# Altium project Ax2WDRobot.PrjPcb
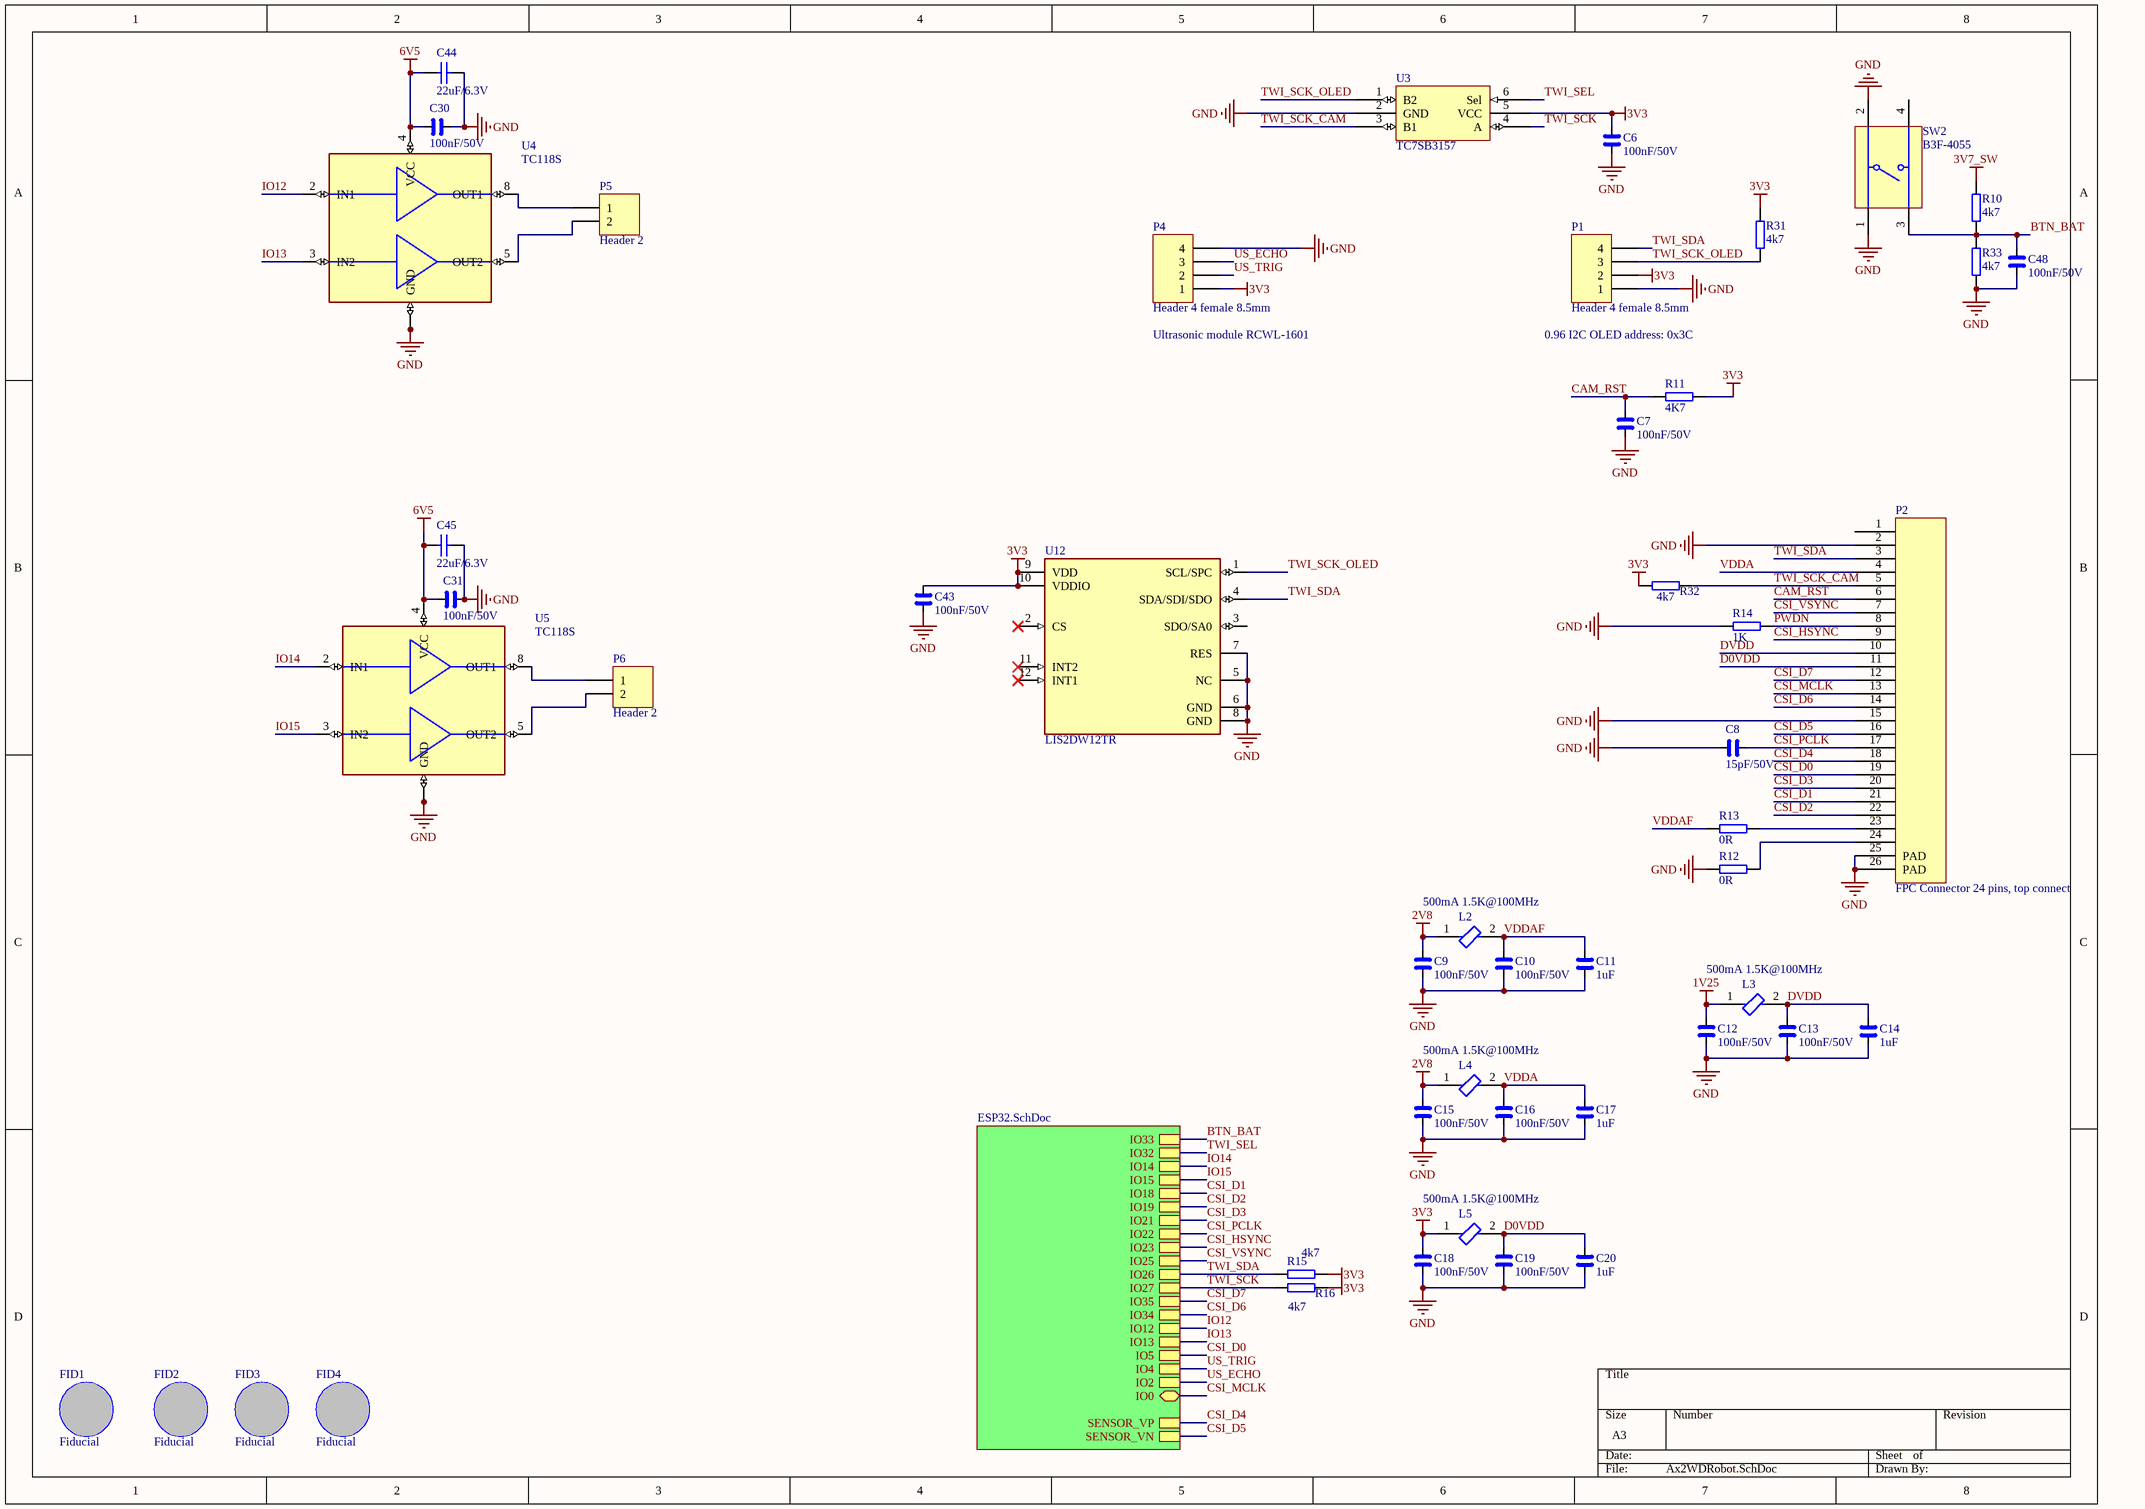
[diagram p0: Ax2WDRobot.SchDoc]
5 sheets, 123 parts. Net scope: hierarchical (ports join the sheet entries above them; power ports are global).
Board file: Ax2WDRobot.PcbDoc
Sheets:
  Ax2WDRobot.SchDoc
     = ESP32.SchDoc
       = CP2102.SchDoc
         = Power.SchDoc
          U_BatteryPower = BatteryPower.SchDoc

## Sheet Ax2WDRobot.SchDoc
size A3; SheetNumber: 1; SheetTotal: 5

### Parts
C6  100nF/50V  [1608[0603]]
C7  100nF/50V  [1608[0603]]
C8  15pF/50V  [1608[0603]]
C9  100nF/50V  [1608[0603]]
C10  100nF/50V  [1608[0603]]
C11  1uF  [1608[0603]]
C12  100nF/50V  [1608[0603]]
C13  100nF/50V  [1608[0603]]
C14  1uF  [1608[0603]]
C15  100nF/50V  [1608[0603]]
C16  100nF/50V  [1608[0603]]
C17  1uF  [1608[0603]]
C18  100nF/50V  [1608[0603]]
C19  100nF/50V  [1608[0603]]
C20  1uF  [1608[0603]]
C30  100nF/50V  [1608[0603]]
C31  100nF/50V  [1608[0603]]
C43  100nF/50V  [1608[0603]]
C44  22uF/6.3V  [1608[0603]]
C45  22uF/6.3V  [1608[0603]]
C48  100nF/50V  [1608[0603]]
FID1  Fiducial  [FIDUCIAL_POLY]  (no BOM)
FID2  Fiducial  [FIDUCIAL_POLY]  (no BOM)
FID3  Fiducial  [FIDUCIAL_POLY]  (no BOM)
FID4  Fiducial  [FIDUCIAL_POLY]  (no BOM)
L2  500mA 1.5K@100MHz  [1608[0603]]
L3  500mA 1.5K@100MHz  [1608[0603]]
L4  500mA 1.5K@100MHz  [1608[0603]]
L5  500mA 1.5K@100MHz  [1608[0603]]
P1  Header 4 female 8.5mm  [BCS-104-L-S-TE]
P2  FPC Connector 24 pins, top connect  [AFC07-S24ECA-00]
P4  Header 4 female 8.5mm  [BCS-104-L-S-TE]
P5  Header 2  [BCS-102-L-S-TE]
P6  Header 2  [BCS-102-L-S-TE]
R10  4k7  [1608[0603]]
R11  4K7  [1608[0603]]
R12  0R  [1608[0603]]  (no BOM)
R13  0R  [1608[0603]]  (no BOM)
R14  1K  [1608[0603]]
R15  4k7  [1608[0603]]
R16  4k7  [1608[0603]]
R31  4k7  [1608[0603]]
R32  4k7  [1608[0603]]
R33  4k7  [1608[0603]]
SW2  B3F-4055  [OMRON-B3F-4055_AX]
U3  TC7SB3157  [SOT-363_MP6D]
U4  TC118S  [SO08]
U5  TC118S  [SO08]
U12  LIS2DW12TR  [FP-LGA12-DM00170568-MFG]

### Sub-sheets
? = ESP32.SchDoc: IO2, IO5, IO34, IO35, IO27, IO26, IO25, IO23, IO22, IO21, IO19, IO18, IO15, SENSOR_VP, SENSOR_VN, IO0 (bidir), IO4, IO33, IO32, IO12, IO13, IO14

### Nets
1V25: C12.2 L3.1
2V8: C9.2 C15.2 L2.1 L4.1
3V3: C6.1 C18.2 C43.1 L5.1 P1.2 P4.1 R11.2 R15.1 R16.1 R31.2 R32.2 U3.5(VCC) U12.9(VDD) U12.10(VDDIO)
3V7_SW: R10.2
6V5: C30.2 C31.2 C44.2 C45.2 U4.4(VCC) U5.4(VCC)
GND: C6.2 C7.1 C8.1 C9.1 C10.1 C11.2 C12.1 C13.1 C14.2 C15.1 C16.1 C17.2 C18.1 C19.1 C20.2 C30.1 C31.1 C43.2 C44.1 C45.1 C48.1 P1.1 P2.2 P2.15 P2.25(PAD) P2.26(PAD) P4.4 R12.1 R14.1 R33.1 SW2.1 SW2.2 U3.2(GND) U4.6(GND) U4.7(GND) U5.6(GND) U5.7(GND) U12.5(NC) U12.6(GND) U12.7(RES) U12.8(GND)
BTN_BAT: C48.2 R10.1 R33.2 SW2.3 ; sheet /IO33
CAM_RST: C7.2 P2.6 R11.1
CSI_D0: P2.19 ; sheet /IO5
CSI_D1: P2.21 ; sheet /IO18
CSI_D2: P2.22 ; sheet /IO19
CSI_D3: P2.20 ; sheet /IO21
CSI_D4: P2.18 ; sheet /SENSOR_VP
CSI_D5: P2.16 ; sheet /SENSOR_VN
CSI_D6: P2.14 ; sheet /IO34
CSI_D7: P2.12 ; sheet /IO35
CSI_HSYNC: P2.9 ; sheet /IO23
CSI_MCLK: P2.13 ; sheet /IO0
CSI_PCLK: C8.2 P2.17 ; sheet /IO22
CSI_VSYNC: P2.7 ; sheet /IO25
D0VDD: C19.2 C20.1 L5.2 P2.11
DVDD: C13.2 C14.1 L3.2 P2.10
IO12: U4.2(IN1) ; sheet /IO12
IO13: U4.3(IN2) ; sheet /IO13
IO14: U5.2(IN1) ; sheet /IO14
IO15: U5.3(IN2) ; sheet /IO15
PWDN: P2.8 R14.2
TWI_SCK: R16.2 U3.4(A) ; sheet /IO27
TWI_SCK_CAM: P2.5 R32.1 U3.3(B1)
TWI_SCK_OLED: P1.3 R31.1 U3.1(B2) U12.1(SCL/SPC)
TWI_SDA: P1.4 P2.3 R15.2 U12.4(SDA/SDI/SDO) ; sheet /IO26
TWI_SEL: U3.6(Sel) ; sheet /IO32
US_ECHO: P4.3 ; sheet /IO2
US_TRIG: P4.2 ; sheet /IO4
VDDA: C16.2 C17.1 L4.2 P2.4
VDDAF: C10.2 C11.1 L2.2 R13.1
NetP2_23: P2.23 R13.2
NetP2_24: P2.24 R12.2
NetP5_1: P5.1 U4.8(OUT1)
NetP5_2: P5.2 U4.5(OUT2)
NetP6_1: P6.1 U5.8(OUT1)
NetP6_2: P6.2 U5.5(OUT2)

Not connected (* = marked no-connect by the designer): P2 1; SW2 4; U12 2(CS)* 3(SDO/SA0) 11(INT2)* 12(INT1)*

### Notes on the sheet
- (near P4) Ultrasonic module RCWL-1601
- 0.96 I2C OLED address: 0x3C

### Library data of the parts
C6 C7 C9 C10 C12 C13 C15 C16 C18 C19 C30 C31 C48 = C: Cap Ceramic 0.1uF 50V X7R 20% SMD 0603 125C Paper T/R; Supplier 1: Digi-Key; Supplier Part Number 1: 1276-1941-1-ND; Case/Package: 0603; LCSCPartNo: C14663
C8 = C: Cap Ceramic 0603; Supplier 1: Digi-Key; Case/Package: 0603; LCSCPartNo: C1644
C11 C14 C17 C20 = C: CAP CER 1UF 10V X5R 0603; Supplier 1: Digi-Key; Supplier Part Number 1: 1276-1866-1-ND; Case/Package: 0603; LCSCPartNo: C15849
C43 = C: Cap Ceramic 0.1uF 50V X7R 20% SMD 0603 125C Paper T/R; Manufacturer: Samsung; Manufacturer Part Number: CL10B104MB8NNNC; Supplier 1: Digi-Key; Supplier Part Number 1: 1276-1941-1-ND; Case/Package: 0603; LCSCPartNo: C14663
C44 C45 = Cap: Capacitor; LCSCPartNo: C59461; Case/Package: 0603
L2-L5 = CMP-0686-00368-3: Chip Ferrite Bead, 0603, 1500Ω @ 100MHz, 0.5Ω, 25%, 500mA; Case/Package: 0603; Supplier 1: Digi-Key; Supplier Part Number 1: 490-5216-1-ND; LCSCPartNo: C82155
P1 P4 = Header 4: Header, 4-Pin; Supplier 1: Digi-Key; LCSCPartNo: C124413
P2 = FPC-CONN-24: LCSCPartNo: C262643
P5 P6 = Header 2: Header, 2-Pin; LatestRevisionDate: 17-Jul-2002; LatestRevisionNote: Re-released for DXP Platform.; Publisher: Altium Limited; LCSCPartNo: C49661
R10 R15 R16 R31-R33 = R: RES SMD 4.7K OHM 1% 1/10W 0603; Supplier 1: Digi-Key; Supplier Part Number 1: 311-4.70KHRCT-ND; Case/Package: 0603; LCSCPartNo: C23162
R11-R14 = R: Res General Purpose Thick Film 0603 1% 1/10W ±100ppm/°C Molded SMD Paper T/R; Supplier 1: Digi-Key; Case/Package: 0603
  R11: LCSCPartNo: C23162
  R12 R13: LCSCPartNo: C21189
  R14: LCSCPartNo: C21190
SW2 = CMP-2000-05902-1: Tactile Switch, 1 to 50 mA, 100 mOhm Max, 5 to 24 VDC, -25 to 70 degC, 4-Pin THD, RoHS, Bulk; LCSCPartNo: C84931
U3 = TC7SB3157CFU: 1-of-2 multiplexer/demultiplexer; LCSCPartNo: C2674458; LCSCAltPartNo: C150170
U12 = CMP-12175-000006-1: ACCEL 2-16G I2C/SPI 12LGA; Manufacturer: STMicroelectronics; Min Supply Voltage: 1.62V; Operating Supply Current: 0.38-90uA; Sensor Output: I2C,SPI; Accel Resolution: 14bits; Max Supply Voltage: 3.6V; Accel Range: 2/4/8/16g; Height: 0.7mm; Device Class L1: Sensors; RoHS: TRUE; Temperature Range Low: -40°C; Category: IC; Mouser Description: Accelerometer Triple ±2g/±4g/±8g/±16g 1.62V to 3.6V 0.244mg/digit/0.488mg/digit/0.976mg/digit/1.952mg/digit 12-Pin LG...; Digikey Description: ACCEL 2-16G I2C/SPI 12LGA; ComponentLink2URL: https://www.st.com/resource/en/datasheet/lis2dw12.pdf; Automotive: No; Manufacturer Part Number: LIS2DW12TR; Lead Free: Yes; Footprint Url: https://www.st.com/content/ccc/resource/technical/document/technical_note/73/17/9c/16/dd/96/4a/01/CD00134799.pdf/files/CD00134799.pdf/jcr:content/translations/en.CD00134799.pdf; Temperature: -40°C to +85°C; Device Class L3: Accelerometers; Package: LGA12-DM00170568; Temperature Range High: +85°C; Device Class L2: Motion Sensors; Octopart: https://octopart.com/lis2dw12tr-stmicroelectronics-77080925; ComponentLink2Description: Datasheet; LCSCPartNo: C189624
U4 U5 = TC118S: LCSCPartNo: C88308

## Sheet ESP32.SchDoc
size A4; SheetNumber: 2; SheetTotal: 5
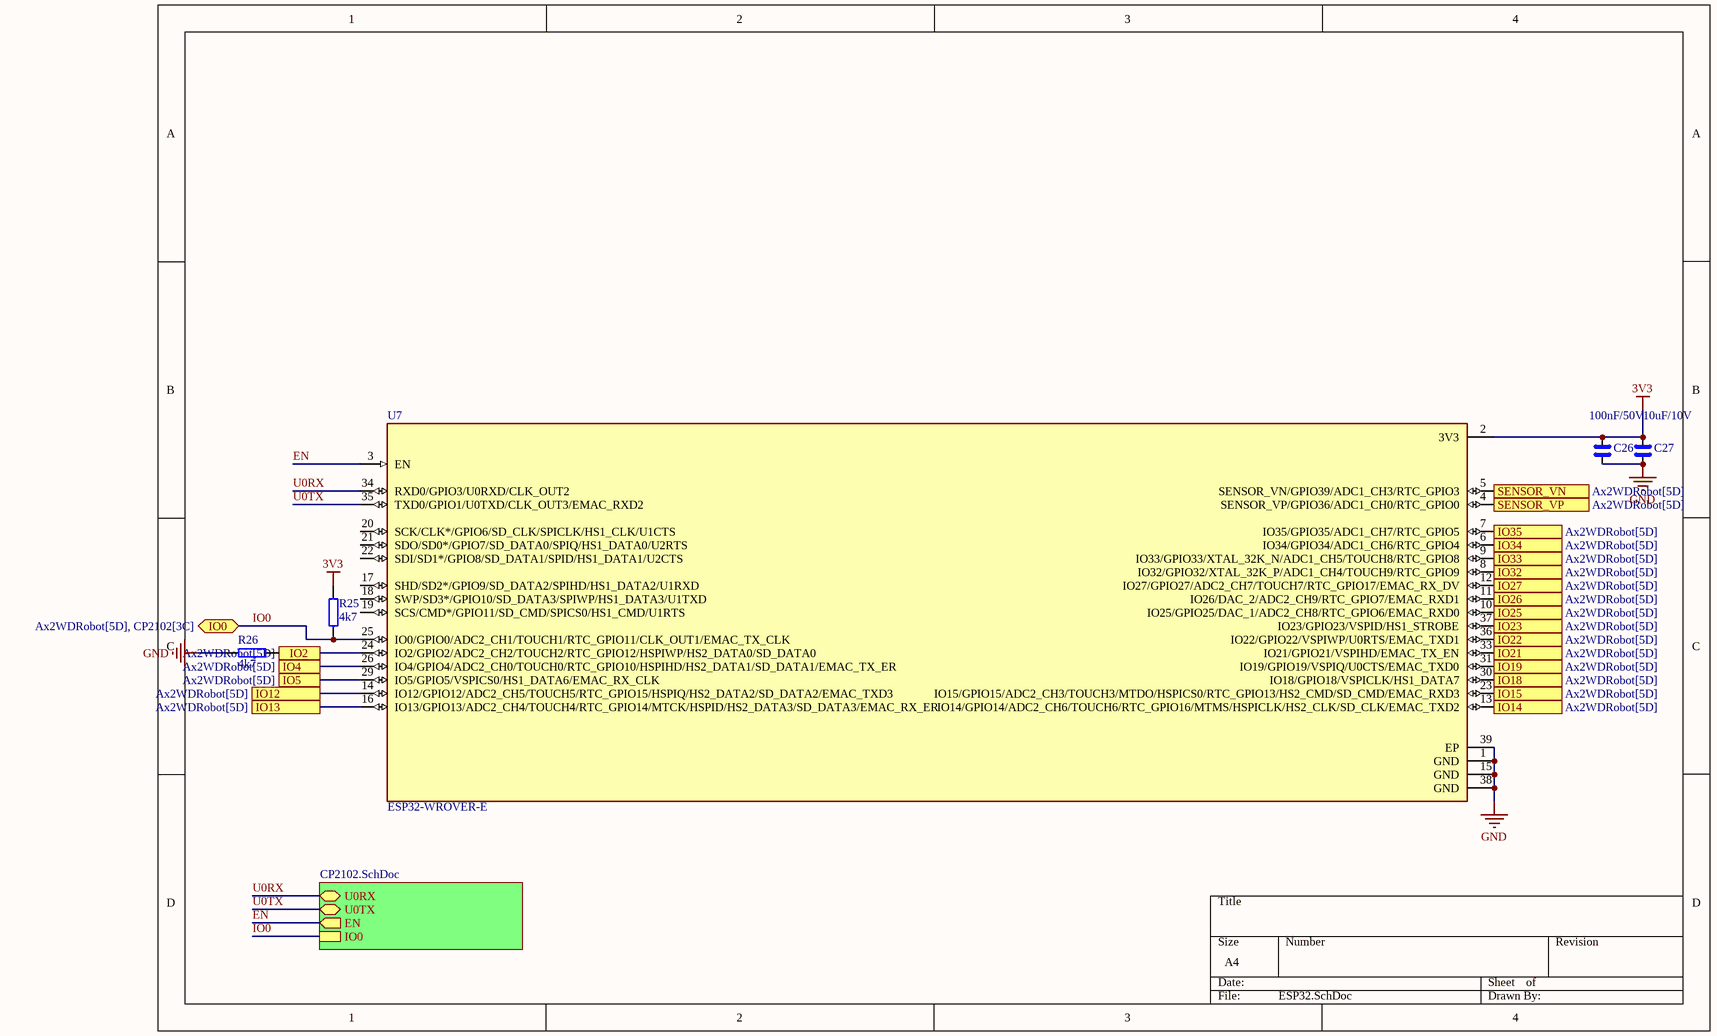
[diagram p1: ESP32.SchDoc]

### Parts
C26  100nF/50V  [1608[0603]]
C27  10uF/10V  [1608[0603]]
R25  4k7  [1608[0603]]
R26  4k7  [1608[0603]]
U7  ESP32-WROVER-E  [XCVR_ESP32-WROVER]

### Sub-sheets
? = CP2102.SchDoc: U0RX (bidir), U0TX (bidir), EN (out), IO0

### Ports
IO0 (bidir, see Ax2WDRobot[5D], CP2102[3C]), IO2 (see Ax2WDRobot[5D]), IO4 (see Ax2WDRobot[5D]), IO5 (see Ax2WDRobot[5D]), IO12 (see Ax2WDRobot[5D]), IO13 (see Ax2WDRobot[5D]), IO14 (see Ax2WDRobot[5D]), IO15 (see Ax2WDRobot[5D]), IO18 (see Ax2WDRobot[5D]), IO19 (see Ax2WDRobot[5D]), IO21 (see Ax2WDRobot[5D]), IO22 (see Ax2WDRobot[5D]), IO23 (see Ax2WDRobot[5D]), IO25 (see Ax2WDRobot[5D]), IO26 (see Ax2WDRobot[5D]), IO27 (see Ax2WDRobot[5D]), IO32 (see Ax2WDRobot[5D]), IO33 (see Ax2WDRobot[5D]), IO34 (see Ax2WDRobot[5D]), IO35 (see Ax2WDRobot[5D]), SENSOR_VN (see Ax2WDRobot[5D]), SENSOR_VP (see Ax2WDRobot[5D])

### Nets
3V3: C26.1 C27.1 R25.2 U7.2(3V3)
GND: C26.2 C27.2 R26.1 U7.1(GND) U7.15(GND) U7.38(GND) U7.39(EP)
BTN_BAT: U7.9(IO33/GPIO33/XTAL_32K_N/ADC1_CH5/TOUCH8/RTC_GPIO8) ; port IO33
CSI_D0: U7.29(IO5/GPIO5/VSPICS0/HS1_DATA6/EMAC_RX_CLK) ; port IO5
CSI_D1: U7.30(IO18/GPIO18/VSPICLK/HS1_DATA7) ; port IO18
CSI_D2: U7.31(IO19/GPIO19/VSPIQ/U0CTS/EMAC_TXD0) ; port IO19
CSI_D3: U7.33(IO21/GPIO21/VSPIHD/EMAC_TX_EN) ; port IO21
CSI_D4: U7.4(SENSOR_VP/GPIO36/ADC1_CH0/RTC_GPIO0) ; port SENSOR_VP
CSI_D5: U7.5(SENSOR_VN/GPIO39/ADC1_CH3/RTC_GPIO3) ; port SENSOR_VN
CSI_D6: U7.6(IO34/GPIO34/ADC1_CH6/RTC_GPIO4) ; port IO34
CSI_D7: U7.7(IO35/GPIO35/ADC1_CH7/RTC_GPIO5) ; port IO35
CSI_HSYNC: U7.37(IO23/GPIO23/VSPID/HS1_STROBE) ; port IO23
CSI_PCLK: U7.36(IO22/GPIO22/VSPIWP/U0RTS/EMAC_TXD1) ; port IO22
CSI_VSYNC: U7.10(IO25/GPIO25/DAC_1/ADC2_CH8/RTC_GPIO6/EMAC_RXD0) ; port IO25
EN: U7.3(EN) ; sheet /EN
IO0: R25.1 U7.25(IO0/GPIO0/ADC2_CH1/TOUCH1/RTC_GPIO11/CLK_OUT1/EMAC_TX_CLK) ; port IO0, sheet /IO0  [project net CSI_MCLK]
IO12: U7.14(IO12/GPIO12/ADC2_CH5/TOUCH5/RTC_GPIO15/HSPIQ/HS2_DATA2/SD_DATA2/EMAC_TXD3) ; port IO12
IO13: U7.16(IO13/GPIO13/ADC2_CH4/TOUCH4/RTC_GPIO14/MTCK/HSPID/HS2_DATA3/SD_DATA3/EMAC_RX_ER) ; port IO13
IO14: U7.13(IO14/GPIO14/ADC2_CH6/TOUCH6/RTC_GPIO16/MTMS/HSPICLK/HS2_CLK/SD_CLK/EMAC_TXD2) ; port IO14
IO15: U7.23(IO15/GPIO15/ADC2_CH3/TOUCH3/MTDO/HSPICS0/RTC_GPIO13/HS2_CMD/SD_CMD/EMAC_RXD3) ; port IO15
TWI_SCK: U7.12(IO27/GPIO27/ADC2_CH7/TOUCH7/RTC_GPIO17/EMAC_RX_DV) ; port IO27
TWI_SDA: U7.11(IO26/DAC_2/ADC2_CH9/RTC_GPIO7/EMAC_RXD1) ; port IO26
TWI_SEL: U7.8(IO32/GPIO32/XTAL_32K_P/ADC1_CH4/TOUCH9/RTC_GPIO9) ; port IO32
U0RX: U7.34(RXD0/GPIO3/U0RXD/CLK_OUT2) ; sheet /U0RX
U0TX: U7.35(TXD0/GPIO1/U0TXD/CLK_OUT3/EMAC_RXD2) ; sheet /U0TX
US_ECHO: R26.2 U7.24(IO2/GPIO2/ADC2_CH2/TOUCH2/RTC_GPIO12/HSPIWP/HS2_DATA0/SD_DATA0) ; port IO2
US_TRIG: U7.26(IO4/GPIO4/ADC2_CH0/TOUCH0/RTC_GPIO10/HSPIHD/HS2_DATA1/SD_DATA1/EMAC_TX_ER) ; port IO4

Not connected (* = marked no-connect by the designer): U7 17(SHD/SD2*/GPIO9/SD_DATA2/SPIHD/HS1_DATA2/U1RXD) 18(SWP/SD3*/GPIO10/SD_DATA3/SPIWP/HS1_DATA3/U1TXD) 19(SCS/CMD*/GPIO11/SD_CMD/SPICS0/HS1_CMD/U1RTS) 20(SCK/CLK*/GPIO6/SD_CLK/SPICLK/HS1_CLK/U1CTS) 21(SDO/SD0*/GPIO7/SD_DATA0/SPIQ/HS1_DATA0/U2RTS) 22(SDI/SD1*/GPIO8/SD_DATA1/SPID/HS1_DATA1/U2CTS)

### Library data of the parts
C26 = C: as C6 on sheet Ax2WDRobot; Supplier 1: Digi-Key; Supplier Part Number 1: 1276-1941-1-ND; Case/Package: 0603; LCSCPartNo: C14663
C27 = C: Capacitor; Supplier 1: Digi-Key; Supplier Part Number 1: 1276-1096-1-ND; Case/Package: 0603; LCSCPartNo: C19702
R25 R26 = R: RES SMD 4.7K OHM 1% 1/10W 0603; Supplier 1: Digi-Key; Supplier Part Number 1: 311-4.70KHRCT-ND; Case/Package: 0603; LCSCPartNo: C23162
U7 = ESP32-WROVER: Bluetooth, WiFi 802.11b/g/n, Bluetooth v4.2 + EDR, Class 1, 2 and 3 Transceiver Module 2.4GHz ~ 2.5GHz PCB Trace Surface Mount; LCSCPartNo: C2973667

## Sheet CP2102.SchDoc
size A4; SheetNumber: 3; SheetTotal: 5
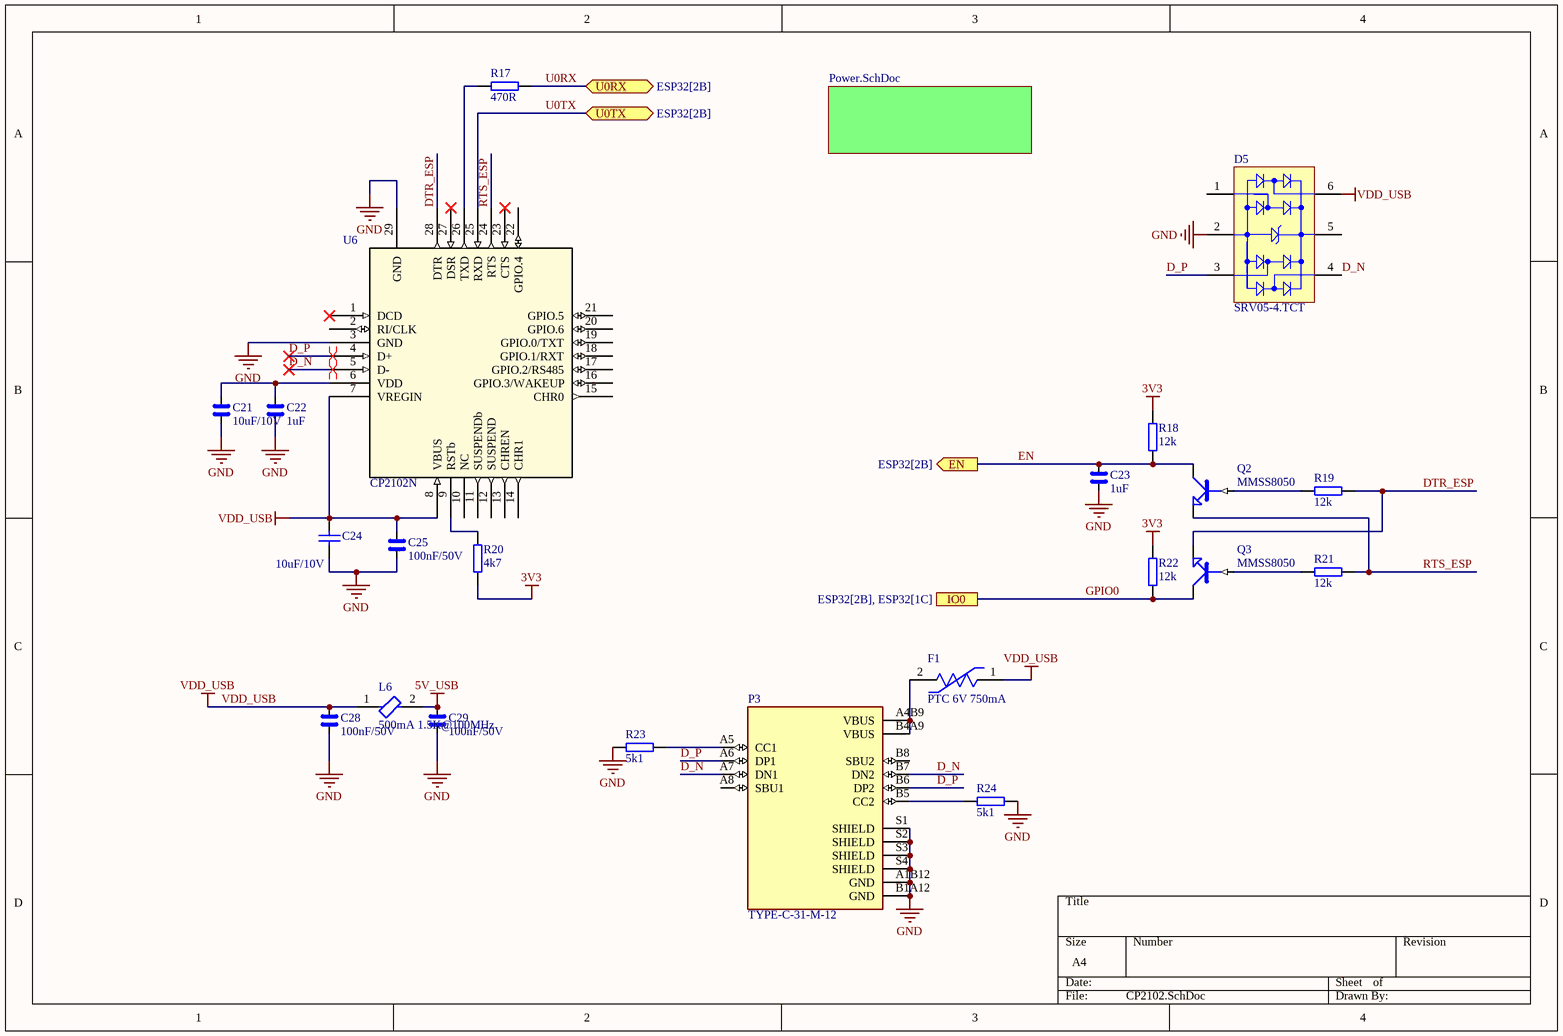
[diagram p2: CP2102.SchDoc]

### Parts
C21  10uF/10V  [1608[0603]]
C22  1uF  [1608[0603]]
C23  1uF  [1608[0603]]
C24  10uF/10V  [1608[0603]]
C25  100nF/50V  [1608[0603]]
C28  100nF/50V  [1608[0603]]
C29  100nF/50V  [1608[0603]]
D5  SRV05-4.TCT  [SMTC-SOT23-6_V]
F1  PTC 6V 750mA  [FP-1206L050YR-MFG]
L6  500mA 1.5K@100MHz  [1608[0603]]
P3  TYPE-C-31-M-12  [HRO_TYPE-C-31-M-12-3D]
Q2  MMSS8050  [SOT-23]
Q3  MMSS8050  [SOT-23]
R17  470R  [1608[0603]]
R18  12k  [1608[0603]]
R19  12k  [1608[0603]]
R20  4k7  [1608[0603]]
R21  12k  [1608[0603]]
R22  12k  [1608[0603]]
R23  5k1  [1608[0603]]
R24  5k1  [1608[0603]]
U6  CP2102N  [QFN28_5X5_SIL]

### Sub-sheets
? = Power.SchDoc: no entries

### Ports
EN (out, see ESP32[2B]), IO0 (see ESP32[2B], ESP32[1C]), U0RX (bidir, see ESP32[2B]), U0TX (bidir, see ESP32[2B])

### Nets
3V3: R18.2 R20.1 R22.2
5V_USB: C29.1 L6.2
GND: C21.2 C22.2 C23.2 C24.1 C25.2 C28.2 C29.2 D5.2(GND) P3.A1B12(GND) P3.B1A12(GND) P3.S1(SHIELD) P3.S2(SHIELD) P3.S3(SHIELD) P3.S4(SHIELD) R23.2 R24.1 U6.3(GND) U6.29(GND)
VDD_USB: C24.2 C25.1 C28.1 D5.6(I/O_4) F1.1 L6.1 U6.7(VREGIN) U6.8(VBUS)
D_N: D5.4(I/O_3) P3.A7(DN1) P3.B7(DN2) U6.5(D-)
D_P: D5.3(I/O_2) P3.A6(DP1) P3.B6(DP2) U6.4(D+)
DTR_ESP: Q3.2(E) R19.2 U6.28(DTR)
EN: C23.1 Q2.3(C) R18.1 ; port EN
GPIO0: Q3.3(C) R22.1 ; port IO0  [project net CSI_MCLK]
RTS_ESP: Q2.2(E) R21.2 U6.24(RTS)
U0RX: R17.1 ; port U0RX
U0TX: U6.25(RXD) ; port U0TX
NetC21_1: C21.1 C22.1 U6.6(VDD)
NetF1_2: F1.2 P3.A4B9(VBUS) P3.B4A9(VBUS)
NetP3_A5: P3.A5(CC1) R23.1
NetP3_B5: P3.B5(CC2) R24.2
NetQ2_1: Q2.1(B) R19.1
NetQ3_1: Q3.1(B) R21.1
NetR17_2: R17.2 U6.26(TXD)
NetR20_2: R20.2 U6.9(RSTb)

Not connected (* = marked no-connect by the designer): D5 1(I/O_1) 5(VBUS); P3 A8(SBU1) B8(SBU2); U6 1(DCD)* 2(RI/CLK) 10(NC) 11(SUSPENDb) 12(SUSPEND) 13(CHREN) 14(CHR1) 15(CHR0) 16(GPIO.3/WAKEUP) 17(GPIO.2/RS485) 18(GPIO.1/RXT) 19(GPIO.0/TXT) 20(GPIO.6) 21(GPIO.5) 22(GPIO.4) 23(CTS)* 27(DSR)*

### Layout directives
differential pair: D_N, D_P

### Library data of the parts
C21 = C: Capacitor; Supplier 1: Digi-Key; Supplier Part Number 1: 1276-1096-1-ND; Case/Package: 0603; LCSCPartNo: C19702
C22 C23 = C: CAP CER 1UF 10V X5R 0603; Supplier 1: Digi-Key; Supplier Part Number 1: 1276-1866-1-ND; Case/Package: 0603; LCSCPartNo: C15849
C24 = Cap: Capacitor; Supplier Part Number 1: 1276-1096-1-ND; Supplier 1: Digi-Key; LCSCPartNo: C19702; Case/Package: 0603
C25 C28 C29 = C: as C6 on sheet Ax2WDRobot; Supplier 1: Digi-Key; Supplier Part Number 1: 1276-1941-1-ND; Case/Package: 0603; LCSCPartNo: C14663
D5 = CMP-2000-05358-1: RailClamp(R) Low Capacitance TVS Diode Array, 5 pF, 17.5 VC, -55 to 125 degC, 6-Pin SOT23, RoHS, Tape and Reel; Case/Package: SOT-23-6L; LCSCPartNo: C85364
F1 = CMP-08606-000073-1: PTC RESET FUSE 6V 750MA 1206; Case/Package: 1206; LCSCPartNo: C70078
L6 = CMP-0686-00368-3: as L2 on sheet Ax2WDRobot; Case/Package: 0603; Supplier 1: Digi-Key; Supplier Part Number 1: 490-5216-1-ND; LCSCPartNo: C82155
P3 = TYPE-C-31-M-12: USB Connectors 24 Receptacle 1 8.94*7.3mm RoHS; LCSCPartNo: C165948
Q2 Q3 = NPN1: TRANS NPN 25V 1.5A SOT23; Supplier 1: Digi-Key; Supplier Part Number 1: MMSS8050-H-TPMSCT-ND; Case/Package: SOT-23; LCSCPartNo: C20526
R17 = R: YAGEO         RC0603FR-07470RL             SMD Chip Resistor, Thick Film, 470 ohm, 50 V, 0603 [1608 Metric], 100 mW,  1%, RC Series; Supplier 1: Digi-Key; Supplier Part Number 1: 311-470HRCT-ND; Case/Package: 0603; LCSCPartNo: C23179
R18 R19 R21 R22 = R: Res Thick Film 0603 12K Ohm 1% 1/10W 100ppm/C Molded SMD SMD Paper T/R; Supplier 1: Digi-Key; Supplier Part Number 1: 541-12.0KHCT-ND; Case/Package: 0603; LCSCPartNo: C22790
R20 = R: RES SMD 4.7K OHM 1% 1/10W 0603; Supplier 1: Digi-Key; Supplier Part Number 1: 311-4.70KHRCT-ND; Case/Package: 0603; LCSCPartNo: C23162
R23 R24 = R: Res Thick Film 0603 5.1KOhm 1% 1/10W 100ppm/C Molded SMD SMD Paper T/R; Supplier 1: Digi-Key; Case/Package: 0603; LCSCPartNo: C23186
U6 = CP2102N-A02-GQFN28: Full Speed USB to UART Bridge USB 2.0 3.3V Tube Automotive 28-Pin QFN EP; Supplier 1: Digi-Key; Supplier Part Number 1: 336-5889-ND; LCSCPartNo: C6568; Case/Package: QFN28

## Sheet Power.SchDoc
size A4; SheetNumber: 4; SheetTotal: 5
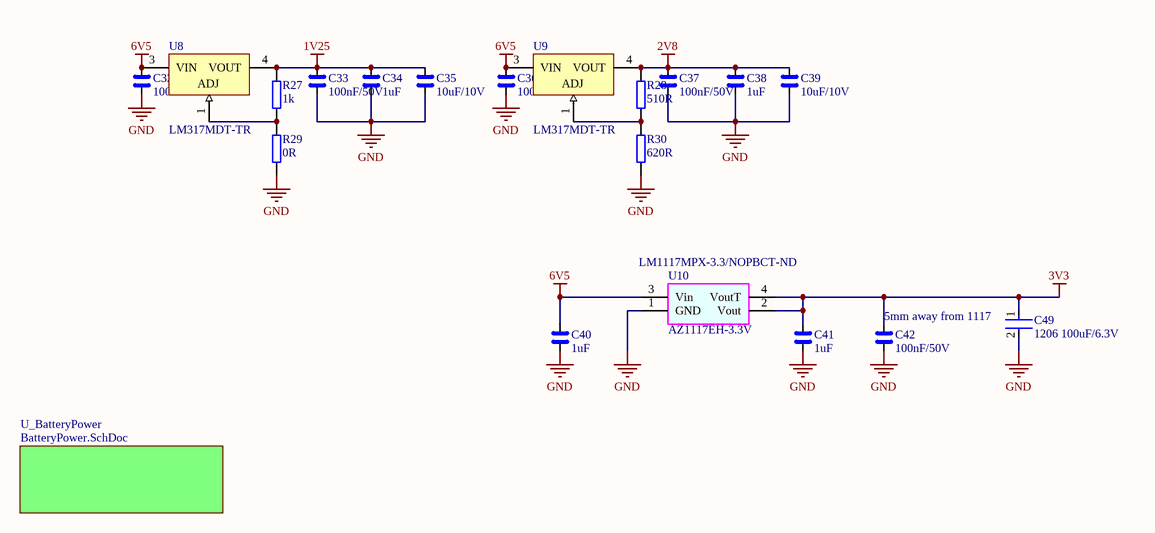
[diagram p3: Power.SchDoc]

### Parts
C32  100nF/50V  [1608[0603]]
C33  100nF/50V  [1608[0603]]
C34  1uF  [1608[0603]]
C35  10uF/10V  [1608[0603]]
C36  100nF/50V  [1608[0603]]
C37  100nF/50V  [1608[0603]]
C38  1uF  [1608[0603]]
C39  10uF/10V  [1608[0603]]
C40  1uF  [1608[0603]]
C41  1uF  [1608[0603]]
C42  100nF/50V  [1608[0603]]
C49  1206 100uF/6.3V  [FP-CL31-IPC_B]
R27  1k  [1608[0603]]
R28  510R  [1608[0603]]
R29  0R  [1608[0603]]
R30  620R  [1608[0603]]
U8  LM317MDT-TR  [TO-252_M]
U9  LM317MDT-TR  [TO-252_M]
U10  AZ1117EH-3.3V  Supplier Part Number 1: LM1117MPX-3.3/NOPBCT-ND  [SOT-223]

### Sub-sheets
U_BatteryPower = BatteryPower.SchDoc: no entries

### Nets
1V25: C33.1 C34.1 C35.1 R27.1 U8.4(VOUT)
2V8: C37.1 C38.1 C39.1 R28.1 U9.4(VOUT)
3V3: C41.1 C42.1 C49.1 U10.2(Vout) U10.4(VoutT)
6V5: C32.1 C36.1 C40.1 U8.3(VIN) U9.3(VIN) U10.3(Vin)
GND: C32.2 C33.2 C34.2 C35.2 C36.2 C37.2 C38.2 C39.2 C40.2 C41.2 C42.2 C49.2 R29.2 R30.2 U10.1(GND)
NetR27_2: R27.2 R29.1 U8.1(ADJ)
NetR28_2: R28.2 R30.1 U9.1(ADJ)

### Notes on the sheet
- (near C42) 5mm away from 1117

### Library data of the parts
C32 C33 C36 C37 C42 = C: as C6 on sheet Ax2WDRobot; Supplier 1: Digi-Key; Supplier Part Number 1: 1276-1941-1-ND; Case/Package: 0603; LCSCPartNo: C14663
C34 C38 C40 C41 = C: CAP CER 1UF 10V X5R 0603; Supplier 1: Digi-Key; Supplier Part Number 1: 1276-1866-1-ND; Case/Package: 0603; LCSCPartNo: C15849
C35 C39 = C: Capacitor; Supplier 1: Digi-Key; Supplier Part Number 1: 1276-1096-1-ND; Case/Package: 0603; LCSCPartNo: C19702
C49 = CMP-13271-000821-1: Cap Ceramic 100uF 6.3V X5R ±20% SMD 1206 +85°C Embossed T/R; LCSCPartNo: C15008
R27-R30 = R: as R11 on sheet Ax2WDRobot; Supplier 1: Digi-Key; Case/Package: 0603
  R27: LCSCPartNo: C21190
  R28: LCSCPartNo: C23193
  R29: LCSCPartNo: C21189
  R30: LCSCPartNo: C23220
U8 U9 = CMP-0244-00074-1: 500mA, Medium Current 1.2 to 37 V Adjustable Voltage Regulator, 3-Pin DPAK, Tape and Reel; Case/Package: DPAK; LCSCPartNo: C75510
U10 = AZ1117EH-3.3V: IC REG LIN 3.3V 800MA SOT223-4; Supplier 1: Digi-Key; Case/Package: SOT-223; LCSCPartNo: C6186

## Sheet BatteryPower.SchDoc
size A3; SheetNumber: 5; SheetTotal: 5; SPICEModelCacheHWZXMDFW: <root> / <DocumentId>HWZXMDFW</DocumentId> / </root>
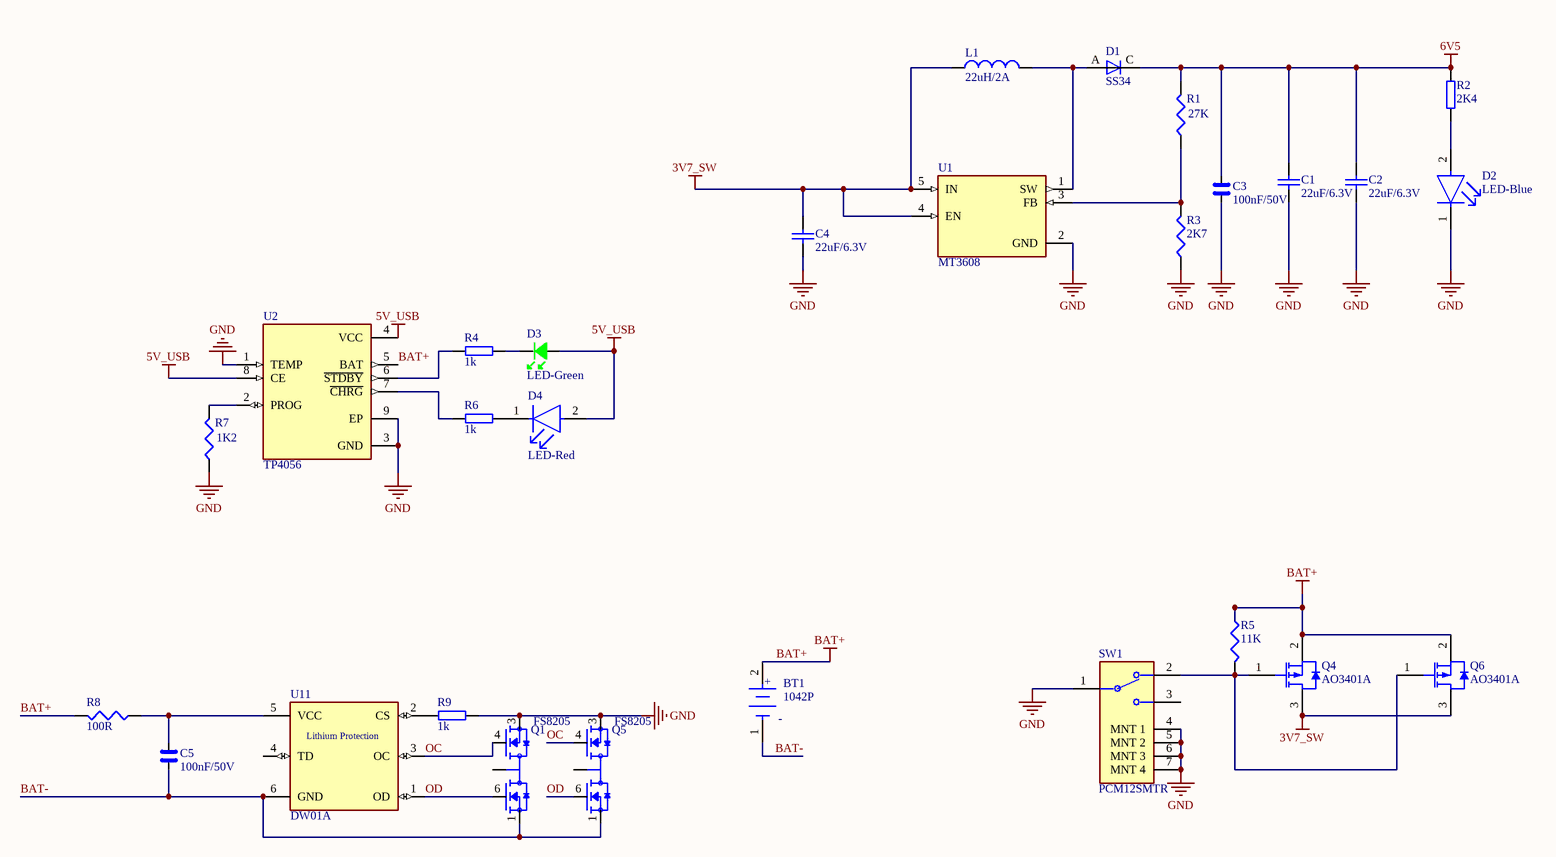
[diagram p4: BatteryPower.SchDoc]

### Parts
BT1  1042P  [FP-1042P-MFG]
C1  22uF/6.3V  [1608[0603]]
C2  22uF/6.3V  [1608[0603]]
C3  100nF/50V  [1608[0603]]
C4  22uF/6.3V  [1608[0603]]
C5  100nF/50V  [1608[0603]]
D1  SS34  [DIOM449X264X300L114X135N]
D2  LED-Blue  [FP-LTST-C193TBKT-5A-MFG]
D3  LED-Green  [LED0603G]
D4  LED-Red  [FP-LTST-C193KRKT-5A-MFG]
L1  22uH/2A  [INDM7166X18N]
Q1  FS8205  [SOT95P280X145-6N]
Q4  AO3401A  [AO-SOT-23-3L_V]
Q5  FS8205  [SOT95P280X145-6N]
Q6  AO3401A  [AO-SOT-23-3L_V]
R1  27K  [J1-0603]
R2  2K4  [1608[0603]]
R3  2K7  [J1-0603]
R4  1k  [1608[0603]]
R5  11K  [J1-0603]
R6  1k  [1608[0603]]
R7  1K2  [J1-0603]
R8  100R  [J1-0603]
R9  1k  [1608[0603]]
SW1  PCM12SMTR  [FP-PCM12SMTR-MFG]
U1  MT3608  [SOT95P280X145-6N]
U2  TP4056  [SOP127P600X175-9N]
U11  DW01A  [SOT23-6]

### Nets
3V7_SW: C4.2 L1.1 Q4.3(DRAIN) Q6.3(DRAIN) U1.4(EN) U1.5(IN)
5V_USB: D3.1 D4.2(A) U2.4(VCC) U2.8(CE)
6V5: C1.2 C2.2 C3.1 D1.C R1.2 R2.1
BAT+: BT1.2(A) Q4.2(SOURCE) Q6.2(SOURCE) R5.1 R8.2 U2.5(BAT)
GND: C1.1 C2.1 C3.2 C4.1 D2.1(C) Q1.3(S2) Q5.3(S2) R3.1 R7.1 R9.1 SW1.1 SW1.4(MNT_1) SW1.5(MNT_2) SW1.6(MNT_3) SW1.7(MNT_4) U1.2(GND) U2.1(TEMP) U2.3(GND) U2.9(EP)
BAT-: BT1.1(C) C5.2 Q1.1(S1) Q5.1(S1) U11.6(GND)
OC: Q1.4(G2) Q5.4(G2) U11.3(OC)
OD: Q1.6(G1) Q5.6(G1) U11.1(OD)
NetC5_1: C5.1 R8.1 U11.5(VCC)
NetD1_A: D1.A L1.2 U1.1(SW)
NetD2_2: D2.2(A) R2.2
NetD3_2: D3.2 R4.2
NetD4_1: D4.1(C) R6.2
NetQ1_2: Q1.2(D12) Q1.5(D12)
NetQ4_1: Q4.1(GATE) Q6.1(GATE) R5.2 SW1.2
NetQ5_2: Q5.2(D12) Q5.5(D12)
NetR1_1: R1.1 R3.2 U1.3(FB)
NetR4_1: R4.1 U2.6(~{STDBY})
NetR6_1: R6.1 U2.7(~{CHRG})
NetR7_2: R7.2 U2.2(PROG)
NetR9_2: R9.2 U11.2(CS)

Not connected (* = marked no-connect by the designer): SW1 3; U11 4(TD)

### Notes on the sheet
- (in symbol CMP-19636-000019-1) +; -
- (in symbol DW01A) Lithium Protection

### Library data of the parts
BT1 = CMP-19636-000019-1: BATTERY HOLDER 18650 SMD TAB; LCSCPartNo: C2988620
C1 C2 C4 = Cap: Capacitor; LCSCPartNo: C59461; Case/Package: 0603
C3 C5 = C: as C6 on sheet Ax2WDRobot; Supplier 1: Digi-Key; Supplier Part Number 1: 1276-1941-1-ND; Case/Package: 0603; LCSCPartNo: C14663
D1 = EGF1B: 0.5mA@40V 40V Single 3A 0.55V@3A SMA(DO-214AC) Schottky; LCSCPartNo: C8678; Case/Package: SMA
D2 = CMP-2000-06624-2: LED BLUE CLEAR CHIP SMD; Case/Package: 0603; LCSCPartNo: C72041
D3 = LED-G: LED GREEN CLEAR CHIP SMD; Supplier 1: Digi-Key; Supplier Part Number 1: 160-1828-1-ND; Case/Package: 0603; LCSCPartNo: C72043
D4 = CMP-2000-06623-2: LED RED CLEAR CHIP SMD; Case/Package: 0603; LCSCPartNo: C2286
L1 = Inductor: LCSCPartNo: C705336
Q1 Q5 = FS8205: Dual N-Channel Enhancement Mode Power MOSFET; MF: Fortune Semiconductor; Package: Package; MP: FS8205; Value: *; Price: None; SnapEDA_Link: https://www.snapeda.com/parts/FS8205/Fortune%20Semiconductor/view-part/3216395/?ref=snap; Check_prices: https://www.snapeda.com/parts/FS8205/Fortune%20Semiconductor/view-part/3216395/?ref=eda; Availability: In Stock; LCSCPartNo: C2830320
Q4 Q6 = CMP-2000-05778-1: P-Channel MOSFET, 30 V, 4 A, -55 to 150 degC, 3-Pin SOT-23-3L, RoHS, Tape and Reel; LCSCPartNo: C15127
R1 R3 R5 R7 R8 = Res3: Resistor
  R1: LCSCPartNo: C22967
  R3: LCSCPartNo: C13167
  R5: LCSCPartNo: C25950; Case/Package: 0603
R2 R4 R6 R9 = R: as R11 on sheet Ax2WDRobot; Supplier 1: Digi-Key; Case/Package: 0603
  R2: LCSCPartNo: C22940
  R4 R6 R9: LCSCPartNo: C21190
SW1 = CMP-2000-06884-2: SWITCH SLIDE SPDT 300MA 6V; LCSCPartNo: C109335
U1 = MT3608: High Efficiency 1.2MHz 2A Step Up Converter; LCSCPartNo: C84817
U2 = TP4056: Complete single cell Li-Ion battery with a constant current / constant voltage linear charger; LCSCPartNo: C16581
U11 = DW01A: SOT-23-6L Battery Management ICs ROHS; LCSCPartNo: C351410

## Nets that join several sheets
1V25: Ax2WDRobot (C12.2 L3.1), Power (5 pins)
2V8: Ax2WDRobot (C9.2 C15.2 L2.1 L4.1), Power (5 pins)
3V3: Ax2WDRobot (14 pins), ESP32 (C26.1 C27.1 R25.2 U7.2), CP2102 (R18.2 R20.1 R22.2), Power (5 pins)
3V7_SW: Ax2WDRobot (R10.2), BatteryPower (6 pins)
5V_USB: CP2102 (C29.1 L6.2), BatteryPower (D3.1 D4.2 U2.4 U2.8)
6V5: Ax2WDRobot (6 pins), Power (6 pins), BatteryPower (6 pins)
GND: Ax2WDRobot (41 pins), ESP32 (7 pins), CP2102 (18 pins), Power (15 pins), BatteryPower (19 pins)
BTN_BAT: Ax2WDRobot (C48.2 R10.1 R33.2 SW2.3), ESP32 (U7.9)
CSI_D0: Ax2WDRobot (P2.19), ESP32 (U7.29)
CSI_D1: Ax2WDRobot (P2.21), ESP32 (U7.30)
CSI_D2: Ax2WDRobot (P2.22), ESP32 (U7.31)
CSI_D3: Ax2WDRobot (P2.20), ESP32 (U7.33)
CSI_D4: Ax2WDRobot (P2.18), ESP32 (U7.4)
CSI_D5: Ax2WDRobot (P2.16), ESP32 (U7.5)
CSI_D6: Ax2WDRobot (P2.14), ESP32 (U7.6)
CSI_D7: Ax2WDRobot (P2.12), ESP32 (U7.7)
CSI_HSYNC: Ax2WDRobot (P2.9), ESP32 (U7.37)
CSI_MCLK: Ax2WDRobot (P2.13), ESP32 (R25.1 U7.25), CP2102 (Q3.3 R22.1)
CSI_PCLK: Ax2WDRobot (C8.2 P2.17), ESP32 (U7.36)
CSI_VSYNC: Ax2WDRobot (P2.7), ESP32 (U7.10)
EN: ESP32 (U7.3), CP2102 (C23.1 Q2.3 R18.1)
IO12: Ax2WDRobot (U4.2), ESP32 (U7.14)
IO13: Ax2WDRobot (U4.3), ESP32 (U7.16)
IO14: Ax2WDRobot (U5.2), ESP32 (U7.13)
IO15: Ax2WDRobot (U5.3), ESP32 (U7.23)
TWI_SCK: Ax2WDRobot (R16.2 U3.4), ESP32 (U7.12)
TWI_SDA: Ax2WDRobot (P1.4 P2.3 R15.2 U12.4), ESP32 (U7.11)
TWI_SEL: Ax2WDRobot (U3.6), ESP32 (U7.8)
U0RX: ESP32 (U7.34), CP2102 (R17.1)
U0TX: ESP32 (U7.35), CP2102 (U6.25)
US_ECHO: Ax2WDRobot (P4.3), ESP32 (R26.2 U7.24)
US_TRIG: Ax2WDRobot (P4.2), ESP32 (U7.26)